# EAGLE design A604F (EAGLE 6.6.0)
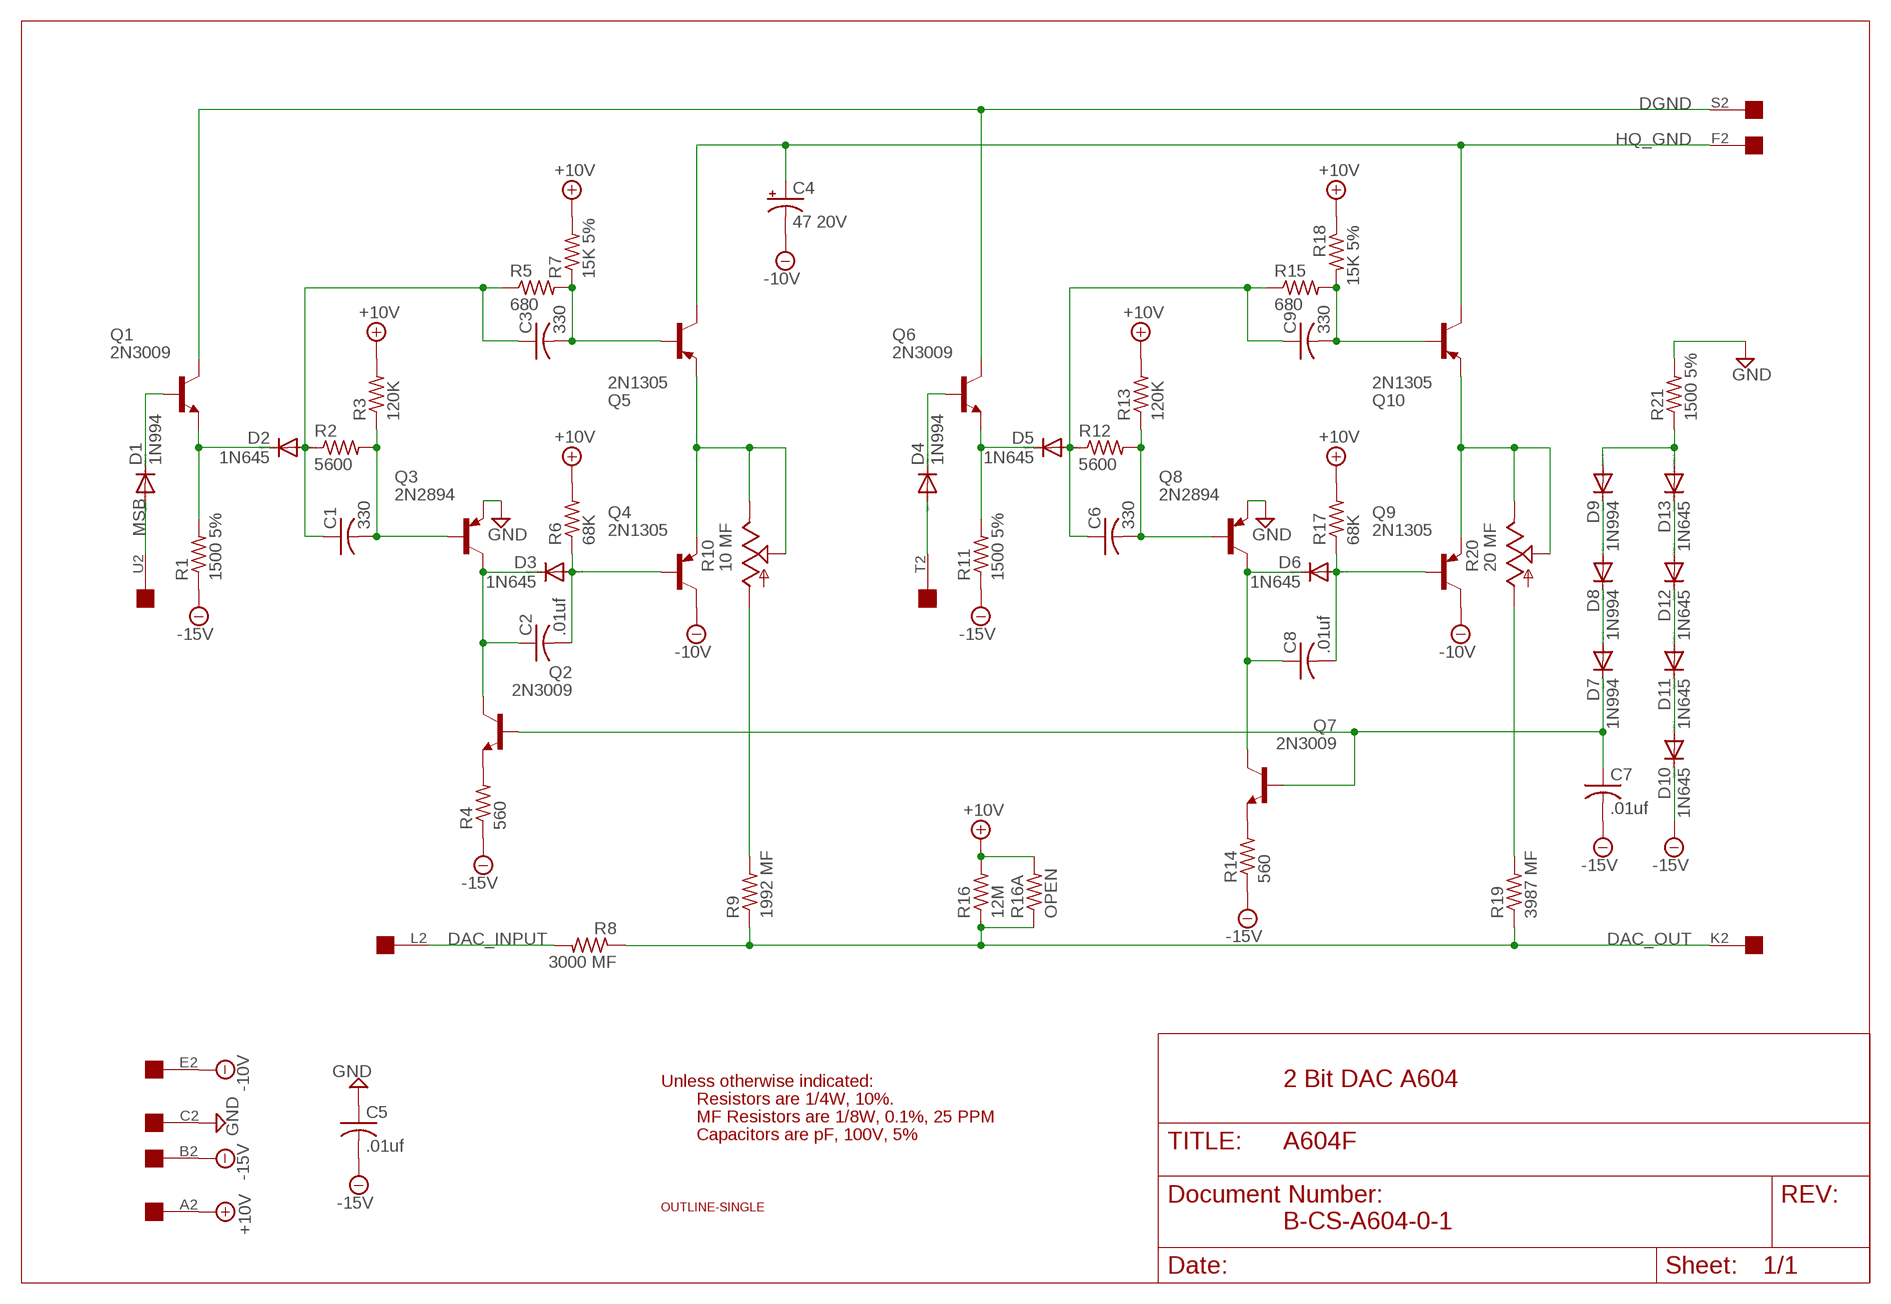
[diagram p0: schematic, sheet 1]

## Parts
C1  330  C-US075-032X103  [C075-032X103]
C2  .01uf  C-US050-025X075  [C050-025X075]
C3  330  C-US075-032X103  [C075-032X103]
C4  47 20V  CPOL-USE20-8AXIAL  [E12-8]
C5  .01uf  C-US050-025X075  [C050-025X075]
C6  330  C-US075-032X103  [C075-032X103]
C7  .01uf  C-US050-025X075  [C050-025X075]
C8  .01uf  C-US050-025X075  [C050-025X075]
C9  330  C-US075-032X103  [C075-032X103]
D1  1N994  1N4148DO35-10  [DO35-10]
D2  1N645  1N4148DO35-10  [DO35-10]
D3  1N645  1N4148DO35-10  [DO35-10]
D4  1N994  1N4148DO35-10  [DO35-10]
D5  1N645  1N4148DO35-10  [DO35-10]
D6  1N645  1N4148DO35-10  [DO35-10]
D7  1N994  1N4148DO35-10  [DO35-10]
D8  1N994  1N4148DO35-10  [DO35-10]
D9  1N994  1N4148DO35-10  [DO35-10]
D10  1N645  1N4148DO35-10  [DO35-10]
D11  1N645  1N4148DO35-10  [DO35-10]
D12  1N645  1N4148DO35-10  [DO35-10]
D13  1N645  1N4148DO35-10  [DO35-10]
Q1  2N3009  2N1613-NPN-TO39-EBC  [TO39]
Q2  2N3009  2N1613-NPN-TO39-EBC  [TO39]
Q3  2N2894  2N2904A  [TO39]
Q4  2N1305  2N2904A  [TO39]
Q5  2N1305  2N2904A  [TO39]
Q6  2N3009  2N1613-NPN-TO39-EBC  [TO39]
Q7  2N3009  2N1613-NPN-TO39-EBC  [TO39]
Q8  2N2894  2N2904A  [TO39]
Q9  2N1305  2N2904A  [TO39]
Q10  2N1305  2N2904A  [TO39]
R1  1500 5%  R-US_0207/10  [0207/10]
R2  5600  R-US_0207/10  [0207/10]
R3  120K  R-US_0207/10  [0207/10]
R4  560  R-US_0207/10  [0207/10]
R5  680  R-US_0207/10  [0207/10]
R6  68K  R-US_0207/10  [0207/10]
R7  15K 5%  R-US_0207/10  [0207/10]
R8  3000 MF  R-US_0207/15  [0207/15]
R9  1992 MF  R-US_0207/15  [0207/15]
R10  10 MF  TRIM_US-S75P  [S75P]
R11  1500 5%  R-US_0207/10  [0207/10]
R12  5600  R-US_0207/10  [0207/10]
R13  120K  R-US_0207/10  [0207/10]
R14  560  R-US_0207/10  [0207/10]
R15  680  R-US_0207/10  [0207/10]
R16  12M  R-US_0207/10  [0207/10]
R16A  OPEN  R-US_0207/15  [0207/15]
R17  68K  R-US_0207/10  [0207/10]
R18  15K 5%  R-US_0207/10  [0207/10]
R19  3987 MF  R-US_0207/15  [0207/15]
R20  20 MF  TRIM_US-S75P  [S75P]
R21  1500 5%  R-US_0207/10  [0207/10]
U$1  OUTLINE-SINGLE  [SINGLE]
U$3  EDGE-1  [EDGE-CON1]

## Nets
+10V [supply]: R3.2 R6.2 R7.2 R13.2 R16.2 R16A.2 R17.2 R18.1 U$3.A2
-10V [supply]: C4.- Q4.3(C) Q9.3(C) U$3.E2
-15V [supply]: C5.2 C7.2 D10.C R1.1 R4.1 R11.1 R14.1 U$3.B2
DAC_INPUT [supply]: R8.2 U$3.L2
DAC_OUT [supply]: R8.1 R9.1 R16.1 R16A.1 R19.1 U$3.K2
DGND: Q1.3(C) Q6.3(C) U$3.S2
GND [supply]: C5.1 Q3.1(E) Q8.1(E) R21.2 U$3.C2
HQ_GND [supply]: C4.+ Q5.3(C) Q10.3(C) U$3.F2
MSB: D1.A U$3.U2
N$1: D1.C Q1.2(B)
N$2: D2.C Q1.1(E) R1.2
N$3: C1.1 C3.1 D2.A R2.1 R5.1
N$4: C1.2 Q3.2(B) R2.2 R3.1
N$5: C3.2 Q5.2(B) R5.2 R7.1
N$6: C2.1 D3.C Q2.3(C) Q3.3(C)
N$7: C2.2 D3.A Q4.2(B) R6.1
N$8: Q4.1(E) Q5.1(E) R10.E R10.S
N$10: D4.C Q6.2(B)
N$11: D5.C Q6.1(E) R11.2
N$12: C6.1 C9.1 D5.A R12.1 R15.1
N$13: C6.2 Q8.2(B) R12.2 R13.1
N$14: C9.2 Q10.2(B) R15.2 R18.2
N$15: C8.1 D6.C Q7.3(C) Q8.3(C)
N$16: C8.2 D6.A Q9.2(B) R17.1
N$17: Q9.1(E) Q10.1(E) R20.E R20.S
N$18: Q2.1(E) R4.2
N$19: R9.2 R10.A
N$20: R19.2 R20.A
N$21: Q7.1(E) R14.2
N$22: C7.1 D7.C Q2.2(B) Q7.2(B)
N$23: D8.A D9.C
N$24: D7.A D8.C
N$25: D10.A D11.C
N$27: D12.A D13.C
N$28: D11.A D12.C
N$30: D9.A D13.A R21.1
T2: D4.A U$3.T2
Unconnected: U$3.D2 U$3.H2 U$3.J2 U$3.M2 U$3.N2 U$3.P2 U$3.R2 U$3.V2

## Notes on the sheet
- Unless otherwise indicated: | 2 Bit DAC A604
- Resistors are 1/4W, 10%.
- MF Resistors are 1/8W, 0.1%, 25 PPM
- Capacitors are pF, 100V, 5%
- B-CS-A604-0-1

## Library data of the parts
C1-C3 C5-C9 = rcl:C-US: CAPACITOR, American symbol
C4 = dec-con:CPOL-USE20-8AXIAL: A 0.8 inch electrolytic.
D1-D13 = diode:1N4148: DIODE high speed (Philips)
Q1 Q2 Q6 Q7 = transistor:*-NPN-: NPN Transistror BF959 corrected 2008.03.06
Q3-Q5 Q8-Q10 = transistor-pnp:2N2904*: PNP Transistror
R1-R9 R11-R16 R16A R17-R19 R21 = rcl:R-US_: RESISTOR, American symbol
R10 R20 = pot:TRIM_US-: POTENTIOMETER
U$1 = dec-con:OUTLINE-*: Board outlines for DEC boards.
U$3 = dec-con:EDGE-1: Single-Sided DEC Edge Connector -- (side 2)

## Net classes
1 supply: width 0.813 mm

## Board
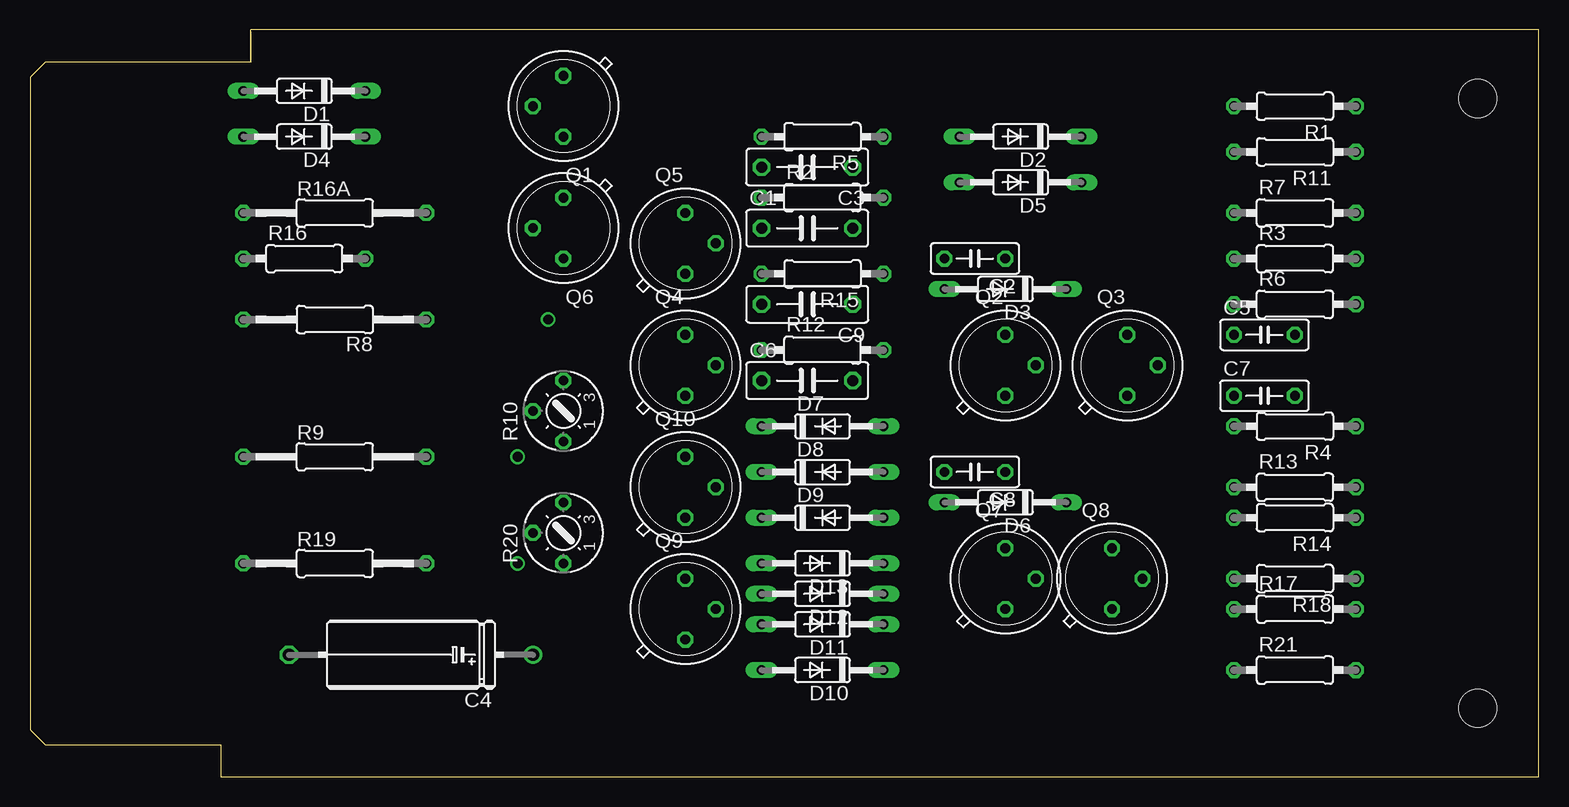
[diagram p1: board, top side]
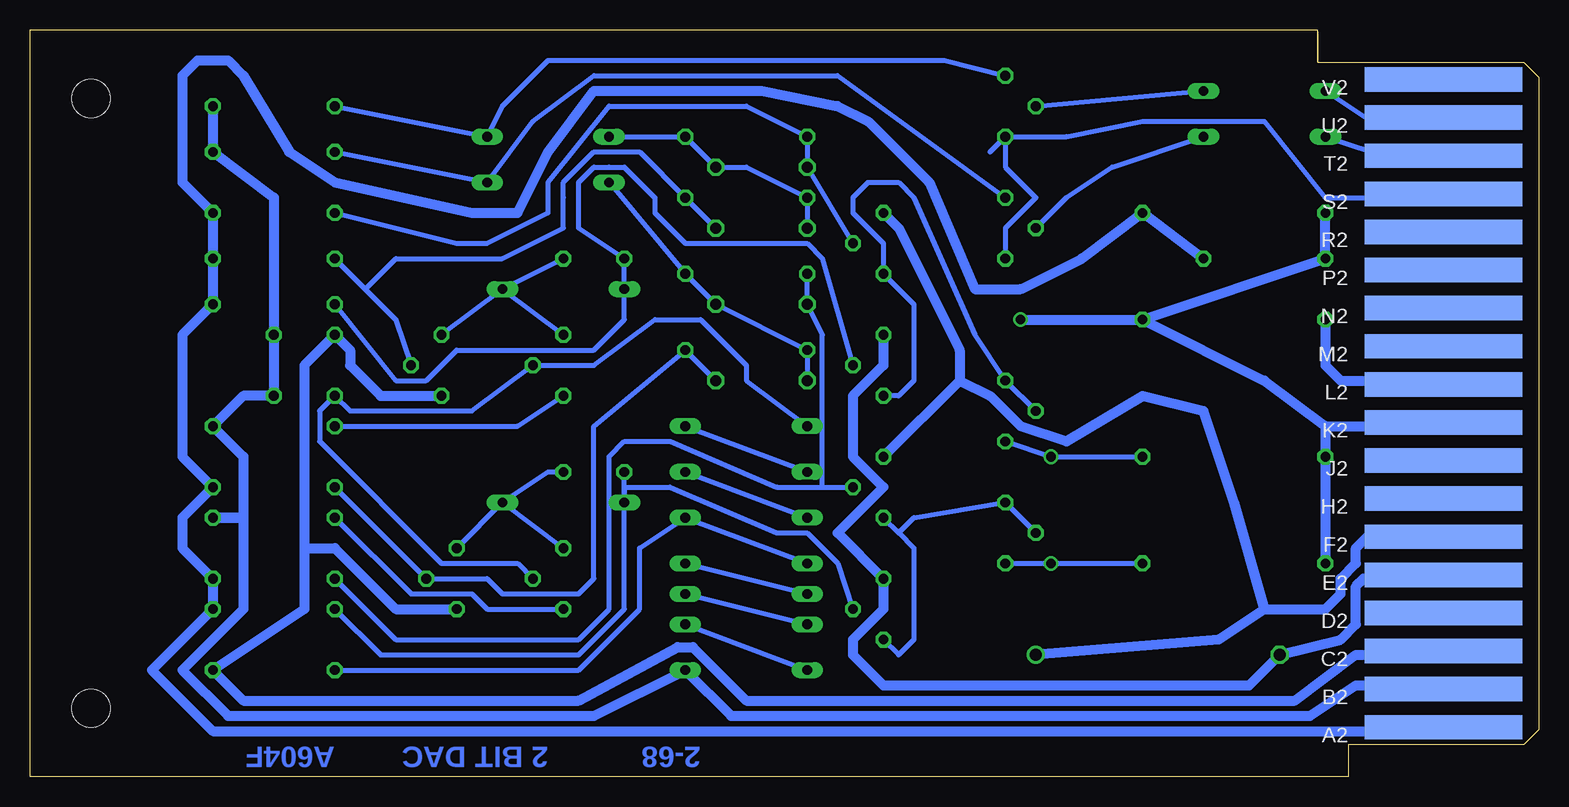
[diagram p2: board, bottom side, seen from below]

Size 125.73 x 62.23 mm. Coordinates in mm from the lower left corner, seen from the top.
Copper layers (1+16): Top 0.035mm / dielectric 1.5mm / Bottom 0.035mm
Design rules "16mils": minimum track width 16mil, minimum drill 32mil, track to track 15mil, track to pad 10mil, pad to pad 10mil, via to via 10mil, smd to smd 10mil, copper to edge 13mil, drill to drill 10mil, minimum pad ring 10mil, minimum via ring 8mil, stop-mask expansion 0mil, vias tented up to drill 0mil, thermal gap 10mil

### Footprints (pad centres in the part's own frame; a part is rotated, then mirrored left to right if it is on the bottom)
C075-032X103 = drill 0.914 octagon: 1 -3.81,0; 2 3.81,0
C050-025X075 = drill 0.813 octagon: 1 -2.54,0; 2 2.54,0
E12-8 = drill 1.016: + -10.16,0 | drill 1.016 octagon: - 10.16,0
DO35-10 = drill 0.813 long: A 5.08,0; C -5.08,0
TO39 = drill 0.813 octagon: 1 0,-2.54; 2 2.54,0; 3 0,2.54
0207/10 = drill 0.813 octagon: 1 -5.08,0; 2 5.08,0
0207/15 = drill 0.813 octagon: 1 -7.62,0; 2 7.62,0
S75P = drill 0.813 octagon: A -2.54,0; E 2.54,0; S 0,2.54
SINGLE = hole 3.175: 120.65,56.515; 120.65,5.715
EDGE-CON1 = smd 13.106 x 2.032 bottom: A2 7.938,4.128; B2 7.938,7.303; C2 7.938,10.477; D2 7.938,13.652; E2 7.938,16.828; F2 7.938,20.003; H2 7.938,23.177; J2 7.938,26.352; K2 7.938,29.527; L2 7.938,32.703; M2 7.938,35.877; N2 7.938,39.053; P2 7.938,42.227; R2 7.938,45.403; S2 7.938,48.578; T2 7.938,51.752; U2 7.938,54.928; V2 7.938,58.102

### Placement (x,y rotation side)
C1  64.77,45.72 0 top
C2  78.74,43.18 180 top
C3  64.77,50.8 180 top
C4  31.75,10.16 180 top
C5  102.87,36.83 0 top
C6  64.77,33.02 0 top
C7  102.87,31.75 0 top
C8  78.74,25.4 180 top
C9  64.77,39.37 180 top
D1  22.86,57.15 180 top
D2  82.55,53.34 180 top
D3  81.28,40.64 180 top
D4  22.86,53.34 180 top
D5  82.55,49.53 180 top
D6  81.28,22.86 180 top
D7  66.04,29.21 0 top
D8  66.04,25.4 0 top
D9  66.04,21.59 0 top
D10  66.04,8.89 180 top
D11  66.04,12.7 180 top
D12  66.04,15.24 180 top
D13  66.04,17.78 180 top
Q1  44.45,55.88 180 top
Q2  81.28,34.29 0 top
Q3  91.44,34.29 0 top
Q4  54.61,34.29 0 top
Q5  54.61,44.45 0 top
Q6  44.45,45.72 180 top
Q7  81.28,16.51 0 top
Q8  90.17,16.51 0 top
Q9  54.61,13.97 0 top
Q10  54.61,24.13 0 top
R1  105.41,55.88 180 top
R2  66.04,48.26 0 top
R3  105.41,43.18 0 top
R4  105.41,29.21 180 top
R5  66.04,53.34 180 top
R6  105.41,39.37 0 top
R7  105.41,46.99 0 top
R8  25.4,38.1 180 top
R9  25.4,26.67 0 top
R10  44.45,30.48 90 top
R11  105.41,52.07 180 top
R12  66.04,35.56 0 top
R13  105.41,24.13 0 top
R14  105.41,21.59 180 top
R15  66.04,41.91 180 top
R16  22.86,43.18 0 top
R16A  25.4,46.99 0 top
R17  105.41,13.97 0 top
R18  105.41,16.51 180 top
R19  25.4,17.78 0 top
R20  44.45,20.32 90 top
R21  105.41,8.89 0 top
U$1  0,0 0 top
U$3  0,0 0 top

### Tracks (layer width: path | path; a pad name or v marks a point on that pad's centre or on a via)
+10V
  Bottom 0.813: U$3.A2 8.51,4.19 8.89,3.81 110.49,3.81 115.57,8.89 R17.2 R18.1 113.03,19.05 113.03,21.59 R13.2 113.03,26.67 113.03,36.83 R6.2 R3.2 R7.2 113.03,49.53 113.03,58.42 111.76,59.69 109.22,59.69 107.95,58.42 104.14,52.07 100.33,49.53 88.9,46.99 85.09,46.99 82.55,52.07 78.74,57.15 64.77,57.15 58.42,55.88 55.88,54.61 50.8,49.53 46.99,40.64 43.18,40.64 38.1,43.18 R16A.2 R16.2
-10V
  Bottom 0.813: U$3.E2 8.56,16.84 8.89,16.51 14.61,16.51 15.24,15.88 15.24,12.7 16.51,11.43 C4.- 24.13,7.62 54.61,7.62 57.15,10.16 57.15,11.43 54.61,13.97 Q9.3 58.42,20.32 54.61,24.13 57.15,26.67 57.15,31.75 54.61,34.29 Q4.3
-15V
  Bottom 0.813: R1.1 R11.1 105.41,48.26 C5.2 105.41,34.29 C7.2 107.95,31.75 R4.1 107.95,26.67 107.95,21.59 | 107.95,21.59 R14.1 107.95,21.59 | 107.95,21.59 107.95,17.78 107.95,13.97 113.03,8.89 109.22,5.08 78.74,5.08 D10.C 67.31,5.08 19.05,5.08 15.24,7.62 8.89,7.62 8.6,7.33 U$3.B2
DAC_INPUT
  Bottom 0.813: U$3.L2 8.56,32.69 8.89,33.02 16.51,33.02 17.78,34.29 R8.2
DAC_OUT  (via drill 0.81)
  Bottom 0.813: U$3.K2 8.59,29.52 8.89,29.21 17.78,29.21 | R19.1 R9.1 17.78,29.21 | R8.1 R16.1 R16A.1 | R8.1 22.86,33.02 17.78,29.21 | v43.18,38.1 R8.1
DGND
  Bottom 0.406: Q1.3 39.37,53.34 33.02,54.61 22.86,54.61 17.78,48.26 10.16,48.26 9.86,48.56 U$3.S2 | Q6.3 44.45,45.72 41.91,48.26 44.45,50.8 Q1.3 | 45.72,52.07 Q1.3
GND
  Bottom 0.813: U$3.C2 8.56,10.49 8.89,10.16 15.24,10.16 20.32,6.35 66.04,6.35 70.49,10.79 71.76,10.79 80.01,6.35 107.95,6.35 R21.2 102.87,13.97 102.87,19.05 | 102.87,19.05 102.87,34.29 C5.1 99.06,35.56 99.06,34.29 96.52,31.75 Q3.1 | Q8.1 95.25,13.97 100.33,19.05 102.87,19.05
HQ_GND
  Bottom 0.813: Q5.3 53.34,45.72 48.26,35.56 48.26,33.02 | 48.26,33.02 Q10.3 | U$3.F2 8.61,20.04 8.89,20.32 13.97,20.32 15.24,19.05 15.24,17.78 16.51,16.51 16.51,15.24 17.78,13.97 22.86,13.97 | C4.+ 26.67,11.43 22.86,13.97 | 48.26,33.02 45.72,31.75 43.18,29.21 39.37,27.94 33.02,31.75 27.94,30.48 25.4,22.86 22.86,13.97
MSB
  Bottom 0.406: U$3.U2 8.53,54.97 8.89,54.61 13.97,54.61 D1.A
N$1
  Bottom 0.406: Q1.2 D1.C
N$2
  Bottom 0.406: R1.2 D2.C 86.36,55.88 82.55,59.69 49.53,59.69 Q1.1
N$3
  Bottom 0.406: D2.A R5.1 C3.1 66.04,50.8 R2.1 C1.1
N$4
  Bottom 0.406: R3.1 97.79,40.64 | 97.79,40.64 95.25,38.1 Q3.2 | C1.2 R2.2 74.93,52.07 77.47,52.07 78.74,52.07 81.28,49.53 81.28,48.26 81.28,45.72 86.36,43.18 95.25,43.18 97.79,40.64
N$5
  Bottom 0.406: R7.1 90.17,44.45 87.63,44.45 82.55,46.99 82.55,48.26 82.55,49.53 77.47,55.88 66.04,55.88 R5.2 C3.2 Q5.2
N$6
  Bottom 0.406: D3.C C2.1 | D3.C Q2.3 | D3.C Q3.3
N$7
  Bottom 0.406: R6.1 95.25,33.02 92.71,33.02 90.17,35.56 78.74,35.56 76.2,38.1 D3.A C2.2 80.01,45.72 80.01,48.26 80.01,49.53 78.74,50.8 77.47,50.8 76.2,50.8 73.66,48.26 73.66,46.99 71.12,44.45 60.96,44.45 59.69,43.18 Q4.2
N$8
  Bottom 0.406: Q4.1 53.34,31.75 52.07,33.02 52.07,39.37 Q5.1 54.61,44.45 57.15,46.99 57.15,48.26 55.88,49.53 53.34,49.53 52.07,48.26 46.99,36.83 R10.E R10.S
N$10
  Bottom 0.406: D4.C 35.56,50.8 39.37,48.26 Q6.2
N$11
  Bottom 0.406: R11.2 D5.C 83.82,54.61 78.74,58.42 58.42,58.42 Q6.1
N$12
  Bottom 0.406: D5.A R15.1 C9.1 R12.1 C6.1
N$13
  Bottom 0.406: C6.2 R12.2 78.74,29.21 78.74,16.51 80.01,15.24 86.36,15.24 87.63,16.51 Q8.2 R13.1
N$14
  Bottom 0.406: R15.2 C9.2 59.69,36.83 59.69,24.13 | 59.69,24.13 63.5,24.13 72.39,27.94 76.2,27.94 77.47,26.67 77.47,13.97 80.01,11.43 95.25,11.43 R18.2 | 59.69,24.13 Q10.2
N$15
  Bottom 0.406: C8.1 82.55,25.4 D6.C | D6.C Q8.3 | D6.C Q7.3
N$16
  Bottom 0.406: D6.A C8.2 | R17.1 96.52,10.16 80.01,10.16 76.2,13.97 D6.A | D6.A 76.2,24.13 72.39,24.13 63.5,20.32 60.96,20.32 58.42,17.78 Q9.2
N$17
  Bottom 0.406: 53.34,20.32 52.07,19.05 52.07,11.43 53.34,10.16 Q9.1 | Q10.1 53.34,20.32 | 53.34,20.32 52.07,21.59 R20.E R20.S
N$18
  Bottom 0.406: R4.2 85.09,29.21 Q2.1
N$19  (via drill 0.81)
  Bottom 0.406: R10.A v40.64,26.67 R9.2
N$20  (via drill 0.81)
  Bottom 0.406: R20.A v40.64,17.78 R19.2
N$21
  Bottom 0.406: R14.2 93.98,15.24 88.9,15.24 87.63,13.97 Q7.1
N$22
  Bottom 0.406: D7.C 66.04,33.02 66.04,34.29 69.85,38.1 73.66,38.1 78.74,34.29 Q2.2 88.9,30.48 99.06,30.48 C7.1 101.6,30.48 101.6,27.94 91.44,17.78 85.09,17.78 Q7.2
N$23
  Bottom 0.406: D8.A D9.C
N$24
  Bottom 0.406: D7.A D8.C
N$25
  Bottom 0.406: D11.C D10.A
N$27
  Bottom 0.406: D13.C D12.A
N$28
  Bottom 0.406: D12.C D11.A
N$30
  Bottom 0.406: D13.A D9.A 74.93,19.05 74.93,13.97 80.01,8.89 R21.1
T2
  Bottom 0.406: U$3.T2 8.56,51.74 8.89,52.07 13.97,52.07 D4.A

### Text on the board
Bottom: 2-68 | 2 BIT DAC | A604F